# EasyEDA Pro project ProPrj_Solid Cell _2026-03-29.epro

# Schematic Schematic1
Board Name: Board1; Create Date: 2026-03-28; Page Name: P1; Project Name: Solid Cell; Schematic Name: Schematic1; Update Date: 2026-03-29; Company: EasyEDA.com; Page Size: A4; Version: V1.0
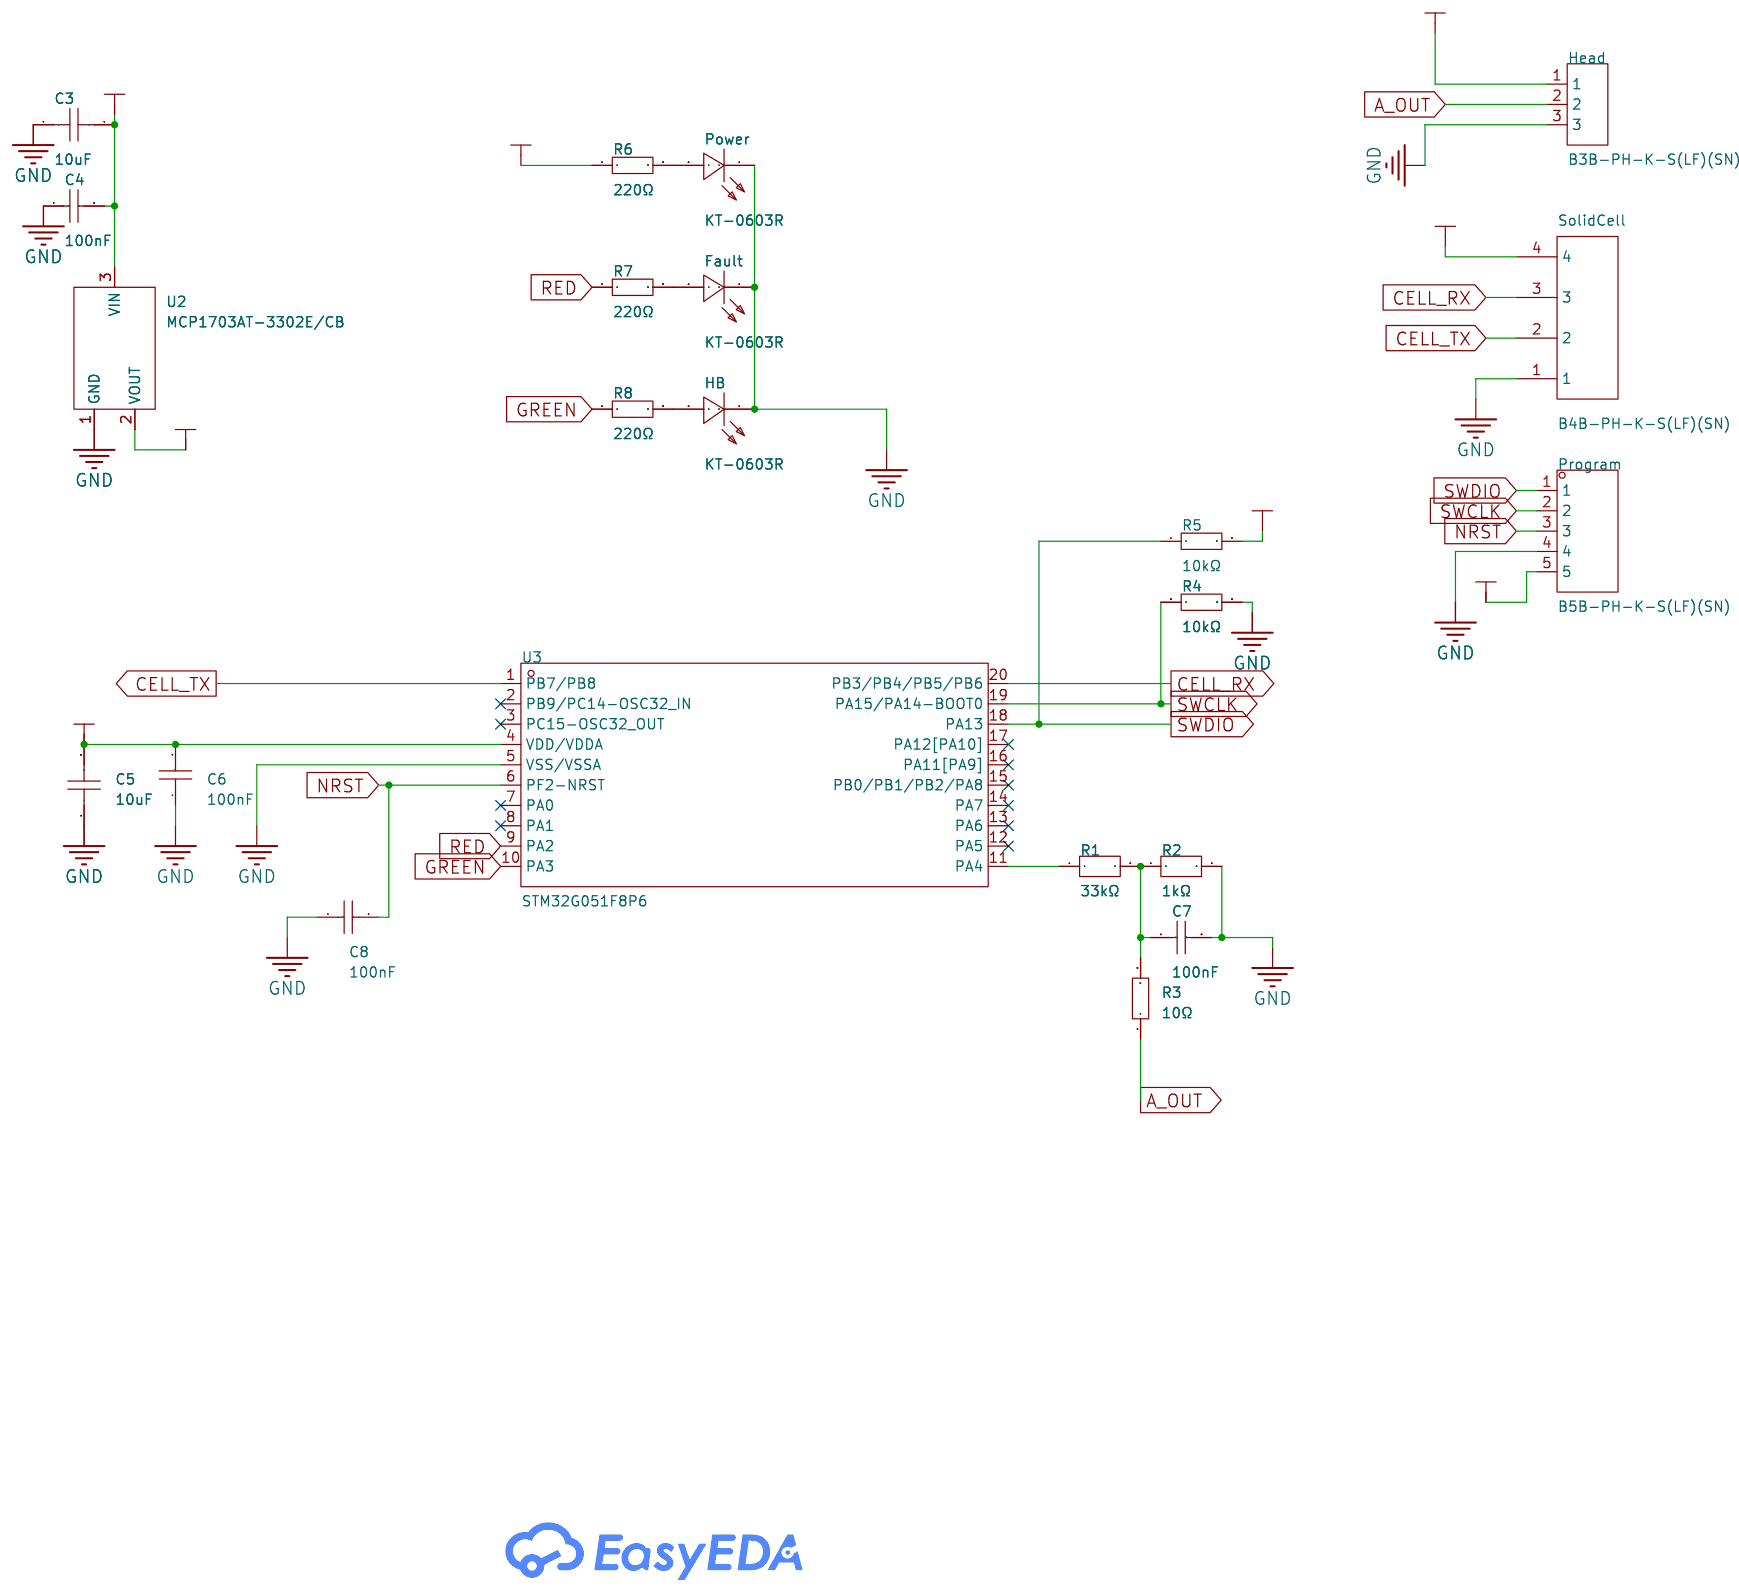
[diagram p0: schematic sheet]

## Parts
C3  10uF  [C0603]
C4  100nF  [C0603]
C5  10uF  [C0603]
C6  100nF  [C0603]
C7  100nF  [C0603]
C8  100nF  [C0603]
Fault  KT-0603R  [LED0603-RD]
HB  KT-0603R  [LED0603-RD]
Head  B3B-PH-K-S(LF)(SN)  [CONN-TH_B3B-PH-K-S]
Power  KT-0603R  [LED0603-RD]
Program  B5B-PH-K-S(LF)(SN)  [CONN-TH_B5B-PH-K-S-LF-SN]
R1  33kΩ  [R0603]
R2  1kΩ  [R0603]
R3  10Ω  [R0603]
R4  10kΩ  [R0603]
R5  10kΩ  [R0603]
R6  220Ω  [R0603]
R7  220Ω  [R0603]
R8  220Ω  [R0603]
SolidCell  B4B-PH-K-S(LF)(SN)  [CONN-TH_B4B-PH-K-S]
U2  MCP1703AT-3302E/CB  [SOT-23-3_L2.9-W1.3-P1.90-LS2.4-BR]
U3  STM32G051F8P6  [TSSOP-20_L6.5-W4.4-P0.65-LS6.4-BL]

## Library data of the parts
C3 C5 = CL10A106MA8NRNC: Capacitance:10uF Tolerance:±20% Tolerance:±20% Voltage Rating:25V Temperature Coefficient:X5R; LCSC Part Name: 10uF ±20% 25V; Supplier Part: C96446; Manufacturer: SAMSUNG(三星); Supplier Footprint: 0603; JLCPCB Part Class: Basic Part; Datasheet: https://item.szlcsc.com/datasheet/CL10A106MA8NRNC/97651.html; Supplier: LCSC; Tolerance: ±20%; Voltage Rating: 25V; Temperature Coefficient: X5R
C4 C6-C8 = CC0603KRX7R9BB104: Capacitance:100nF Tolerance:±10% Tolerance:±10% Voltage Rating:50V Temperature Coefficient:X7R; LCSC Part Name: 100nF ±10% 50V; Supplier Part: C14663; Manufacturer: YAGEO(国巨); Supplier Footprint: 0603; JLCPCB Part Class: Basic Part; Datasheet: https://item.szlcsc.com/datasheet/CC0603KRX7R9BB104/15331.html; Supplier: LCSC; Tolerance: ±10%; Voltage Rating: 50V; Temperature Coefficient: X7R; Check: true
Fault HB Power = KT-0603R: Lamp Holder Type:- Illumination Color:Red Voltage - Forward(Vf):1.8V~2.4V Voltage - Forward(Vf):1.8V~2.4V Power(Watts):40mW Forward Current:20mA Wavelength - Dominant:615nm~630nm Wavelength - Dominant:615nm~630nm Peak Wavelength:645nm Diode Configuration:; LCSC Part Name: 0603 红灯 高亮; Supplier Part: C2286; Manufacturer: KENTO; Supplier Footprint: 0603; JLCPCB Part Class: Basic Part; Datasheet: https://item.szlcsc.com/datasheet/KT-0603R/2659.html; Supplier: LCSC; Illumination Color: Red; Voltage - Forward(Vf): 1.8V~2.4V; Power(Watts): 40mW; Forward Current: 20mA; Wavelength - Dominant: 615nm~630nm; Peak Wavelength: 645nm; Diode Configuration: Discrete Diode; Lens Color: Water Clear; Luminous Intensity: 300mcd; Viewing Angle: 120°; Operating Temperature: -40℃~+85℃
Head = B3B-PH-K-S(LF)(SN): Pins Structure:1x3P Pitch:2mm Mounting Type:Through Hole Reference Series:PH Number of Pins:3P Number of Rows:1 Number of PINs Per Row:3 Row Spacing:- Current Rating:2A Contact Material:Brass Contact Plating:Tin Operating Temperature:-25℃~+85℃ Operating T; LCSC Part Name: 1x3P 间距:2mm 直插 系列:PH; Supplier Part: C131339; Manufacturer: JST; Supplier Footprint: 插件,P=2mm; JLCPCB Part Class: Extended Part; Datasheet: https://item.szlcsc.com/datasheet/B3B-PH-K-S(LF)(SN)/142632.html; Supplier: LCSC; Pins Structure: 1x3P; Pitch: 2mm; Mounting Type: Through Hole; Reference Series: PH; Number of Pins: 3P; Number of Rows: 1; Number of PINs Per Row: 3; Current Rating: 2A; Contact Material: Brass; Contact Plating: Tin; Operating Temperature: -25℃~+85℃; Voltage Rating: 100V; Plastic Material: PA66; Flame Retardant Rating: UL94V-0; Supplementary Features: K Pin; Color: White; Z-Height of the Board: 6mm; X-Length of Bottom Edge on Board (Spacing Line): 7.9mm; Y-Width of Bottom Edge on Board: 4.5mm; Check: true
Program = B5B-PH-K-S(LF)(SN): Pins Structure:1x5P Pitch:2mm Mounting Type:Through Hole Reference Series:PH Number of Pins:5P Number of Rows:1 Number of PINs Per Row:5 Row Spacing:- Current Rating:2A Contact Material:Brass Contact Plating:Tin Operating Temperature:-25℃~+85℃ Operating T; LCSC Part Name: 1x5P 间距:2mm 直插 系列:PH; Supplier Part: C157993; Manufacturer: JST; Supplier Footprint: 插件,P=2mm; JLCPCB Part Class: Extended Part; Datasheet: https://item.szlcsc.com/datasheet/B5B-PH-K-S(LF)(SN)/169341.html; Supplier: LCSC; Pins Structure: 1x5P; Pitch: 2mm; Mounting Type: Through Hole; Reference Series: PH; Number of Pins: 5P; Number of Rows: 1; Number of PINs Per Row: 5; Current Rating: 2A; Contact Material: Brass; Contact Plating: Tin; Operating Temperature: -25℃~+85℃; Voltage Rating: 100V; Plastic Material: PA66; Flame Retardant Rating: UL94V-0; Supplementary Features: K Pin; Color: White; Z-Height of the Board: 6mm; X-Length of Bottom Edge on Board (Spacing Line): 11.9mm; Y-Width of Bottom Edge on Board: 4.5mm; Check: true
R1 = 0603WAF3302T5E: Type:Thick Film Resistor Resistance:33kΩ Tolerance:±1% Tolerance:±1% Power(Watts):100mW Voltage-Supply(Max):75V Temperature Coefficient:±100ppm/℃ Temperature Coefficient:±100ppm/℃ Operating Temperature:-55℃~+155℃ Operating Temperature:-55℃~+155℃; LCSC Part Name: 33kΩ ±1% 100mW 厚膜电阻; Supplier Part: C4216; Manufacturer: UNI-ROYAL(厚声); Supplier Footprint: 0603; JLCPCB Part Class: Basic Part; Datasheet: https://item.szlcsc.com/datasheet/0603WAF3302T5E/4623.html; Supplier: LCSC; Type: Thick Film Resistor; Tolerance: ±1%; Power(Watts): 100mW; Voltage-Supply(Max): 75V; Temperature Coefficient: ±100ppm/℃; Operating Temperature: -55℃~+155℃
R2 = 0603WAF1001T5E: Type:Thick Film Resistor Resistance:1kΩ Tolerance:±1% Tolerance:±1% Power(Watts):100mW Voltage-Supply(Max):75V Temperature Coefficient:±100ppm/℃ Temperature Coefficient:±100ppm/℃ Operating Temperature:-55℃~+155℃ Operating Temperature:-55℃~+155℃; LCSC Part Name: 1kΩ ±1% 100mW 厚膜电阻; Supplier Part: C21190; Manufacturer: UNI-ROYAL(厚声); Supplier Footprint: 0603; JLCPCB Part Class: Basic Part; Datasheet: https://item.szlcsc.com/datasheet/0603WAF1001T5E/21904.html; Supplier: LCSC; Type: Thick Film Resistor; Tolerance: ±1%; Power(Watts): 100mW; Voltage-Supply(Max): 75V; Temperature Coefficient: ±100ppm/℃; Operating Temperature: -55℃~+155℃
R3 = 0603WAF100JT5E: Type:Thick Film Resistor Resistance:10Ω Tolerance:±1% Tolerance:±1% Power(Watts):100mW Voltage-Supply(Max):75V Temperature Coefficient:±400ppm/℃ Temperature Coefficient:±400ppm/℃ Operating Temperature:-55℃~+155℃ Operating Temperature:-55℃~+155℃; LCSC Part Name: 10Ω ±1% 100mW 厚膜电阻; Supplier Part: C22859; Manufacturer: UNI-ROYAL(厚声); Supplier Footprint: 0603; JLCPCB Part Class: Basic Part; Datasheet: https://item.szlcsc.com/datasheet/0603WAF100JT5E/23586.html; Supplier: LCSC; Type: Thick Film Resistor; Tolerance: ±1%; Power(Watts): 100mW; Voltage-Supply(Max): 75V; Temperature Coefficient: ±400ppm/℃; Operating Temperature: -55℃~+155℃
R4 R5 = 0603WAF1002T5E: Type:Thick Film Resistor Resistance:10kΩ Tolerance:±1% Tolerance:±1% Power(Watts):100mW Voltage-Supply(Max):75V Temperature Coefficient:±100ppm/℃ Temperature Coefficient:±100ppm/℃ Operating Temperature:-55℃~+155℃ Operating Temperature:-55℃~+155℃; LCSC Part Name: 厚膜电阻 10kΩ ±1% 100mW; Supplier Part: C25804; Manufacturer: UNI-ROYAL(厚声); Supplier Footprint: 0603; JLCPCB Part Class: Basic Part; Datasheet: https://item.szlcsc.com/datasheet/0603WAF1002T5E/26547.html; Supplier: LCSC; Type: Thick Film Resistor; Tolerance: ±1%; Power(Watts): 100mW; Voltage-Supply(Max): 75V; Temperature Coefficient: ±100ppm/℃; Operating Temperature: -55℃~+155℃
R6-R8 = 0603WAF2200T5E: Type:Thick Film Resistors Resistance: Tolerance:±1% Tolerance:±1% Power(Watts): Overload Voltage (Max): Temperature Coefficient:±100ppm/℃ Temperature Coefficient:±100ppm/℃ Operating Temperature Range:-55℃~+155℃ Operating Temperature Range:-55℃~+155℃; LCSC Part Name: 220Ω ±1% 100mW 厚膜电阻; Supplier Part: C22962; Manufacturer: UNI-ROYAL(厚声); Supplier Footprint: 0603; JLCPCB Part Class: Basic Part; Datasheet: https://atta.szlcsc.com/upload/public/pdf/source/20200306/C422600_1E6D84923E4A46A82E41ADD87F860B5C.pdf; Supplier: LCSC; Type: Thick Film Resistors; Tolerance: ±1%; Temperature Coefficient: ±100ppm/℃; Operating Temperature Range: -55℃~+155℃
SolidCell = B4B-PH-K-S(LF)(SN)_C131334: Pins Structure:1x4P Pitch:2mm Mounting Type:Through Hole Reference Series:PH Number of Pins:4P Number of Rows:1 Number of PINs Per Row:4 Row Spacing:- Current Rating:2A Contact Material:Brass Contact Plating:Tin Operating Temperature:-25℃~+85℃ Operating T; LCSC Part Name: 1x4P 间距:2mm 直插 系列:PH; Supplier Part: C131334; Manufacturer: JST; Supplier Footprint: 插件,P=2mm; JLCPCB Part Class: Extended Part; Datasheet: https://item.szlcsc.com/datasheet/B4B-PH-K-S(LF)(SN)/142627.html; Supplier: LCSC; Pins Structure: 1x4P; Pitch: 2mm; Mounting Type: Through Hole; Reference Series: PH; Number of Pins: 4P; Number of Rows: 1; Number of PINs Per Row: 4; Current Rating: 2A; Contact Material: Brass; Contact Plating: Tin; Operating Temperature: -25℃~+85℃; Voltage Rating: 100V; Plastic Material: PA66; Flame Retardant Rating: UL94V-0; Supplementary Features: K Pin; Color: White; Z-Height of the Board: 6mm; X-Length of Bottom Edge on Board (Spacing Line): 9.9mm; Y-Width of Bottom Edge on Board: 4.5mm; Check: true
U2 = MCP1703AT-3302E/CB: Output Type:Fixed Voltage - Supply:16V Output Voltage:3.3V Output Voltage:3.3V Output Current:250mA Power Supply Rejection Ratio (PSRR):35dB@(100Hz) Voltage Dropout:625mV@(250mA) standby current:2uA Noise:- Features:Over Current Protection；Short Circuit P; LCSC Part Name: 输入16V 输出3.3V 250mA; Supplier Part: C144183; Manufacturer: MICROCHIP(美国微芯); Supplier Footprint: SOT-23A-3; JLCPCB Part Class: Extended Part; Datasheet: https://item.szlcsc.com/datasheet/MCP1703AT-3302E%252FCB/155515.html; Supplier: LCSC; Output Type: Fixed; Voltage - Supply: 16V; Output Voltage: 3.3V; Output Current: 250mA; Power Supply Rejection Ratio (PSRR): 35dB@(100Hz); Voltage Dropout: 625mV@(250mA); standby current: 2uA; Features: Over Current Protection；Short Circuit Protection；Over Temperature Protection; Operating Temperature: -40℃~+125℃@(Tj); Output Configuration: Positive; Number of Outputs: 1; Check: true
U3 = STM32G051F8P6: LCSC Part Name: 主流Arm Cortex-M0+ 32位MCU，最高64KB闪存，18KB内存，2个USART，定时器，ADC，DAC，通信接口，1.7-3.6V; Supplier Part: C5270207; Manufacturer: ST(意法半导体); Supplier Footprint: TSSOP-20; JLCPCB Part Class: Extended Part; Datasheet: https://item.szlcsc.com/datasheet/STM32G051F8P6/5996616.html; Supplier: LCSC; Check: true

## Nets
+3V3: C5.2 C6.2 Program.5 R5.2 R6.1 SolidCell.4 U2.2(VOUT) U3.4(VDD/VDDA)
+7.5V: C3.2 C4.2 Head.1 U2.3(VIN)
GND: C3.1 C4.1 C5.1 C6.1 C7.2 C8.1 Fault.1(K) HB.1(K) Head.3 Power.1(K) Program.4 R2.2 R4.2 SolidCell.1 U2.1(GND) U3.5(VSS/VSSA)
A_OUT: Head.2 R3.1
CELL_RX: SolidCell.3 U3.20(PB3/PB4/PB5/PB6)
CELL_TX: SolidCell.2 U3.1(PB7/PB8)
GREEN: R8.1 U3.10(PA3)
NRST: C8.2 Program.3 U3.6(PF2-NRST)
RED: R7.1 U3.9(PA2)
SWCLK: Program.2 R4.1 U3.19(PA15/PA14-BOOT0)
SWDIO: Program.1 R5.1 U3.18(PA13)
$1N1443: C7.1 R1.2 R2.1 R3.2
$1N4879: R1.1 U3.11(PA4)
$1N7664: Power.2(A) R6.2
$1N7668: Fault.2(A) R7.2
$1N7672: HB.2(A) R8.2

Not connected (* = marked no-connect by the designer): U3 2(PB9/PC14-OSC32_IN)* 3(PC15-OSC32_OUT)* 7(PA0)* 8(PA1)* 12(PA5)* 13(PA6)* 14(PA7)* 15(PB0/PB1/PB2/PA8)* 16(PA11[PA9])* 17(PA12[PA10])*

# Board PCB1
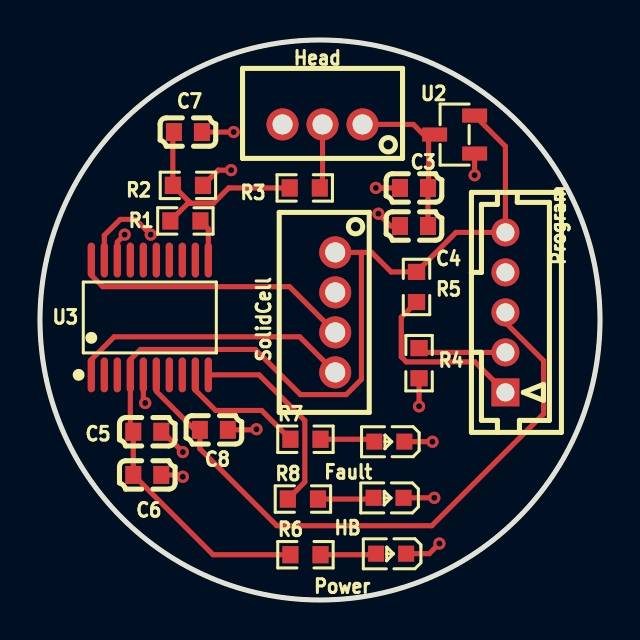
[diagram p1: board, top side]
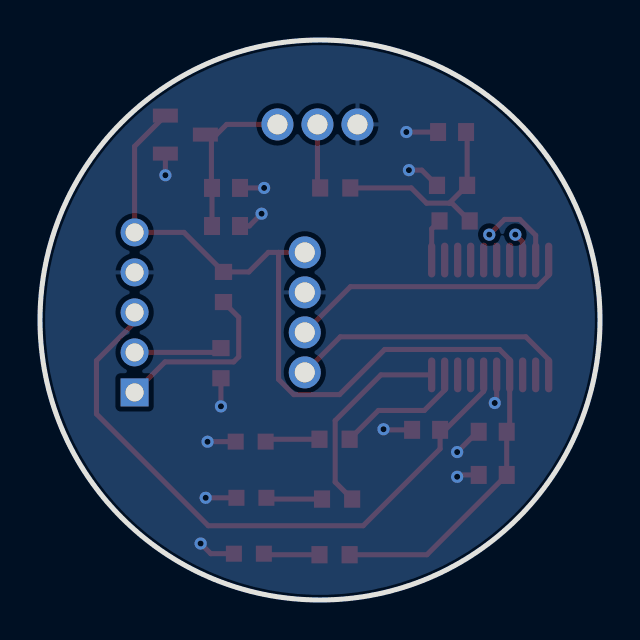
[diagram p2: board, bottom side, seen from below]

Outline 28 x 28 mm; copper layers: Top Layer, Inner1, Inner2, Bottom Layer. Coordinates in mm from the lower left corner of the outline.
Outline path: circle c14,14 r14
Stack: Top Layer 0.035mm Outer layer thickness 1oz / Dielectric1 0.2104mm 7628 RC49% 8.6mil / Inner1 0.0152mm Inner layer thickness / Dielectric2 1.065mm 1.1mm H/HOZ Copper / Inner2 0.0152mm Inner layer thickness / Dielectric3 0.2104mm 7628 RC49% 8.6mil / Bottom Layer 0.035mm Outer layer thickness 1oz

## Design rules (mm)
template: JLCPCB Capability(Two Layers Board)
spacing copperThickness1oz (default): track to track 0.102, other pairs 0.152 to 0.3
spacing copperThickness2oz: track to track 0.203, other pairs 0.152 to 0.3
track width copperThickness1oz (default): min 0.127, default 0.254, max 2.54
track width copperThickness2oz: min 0.203, default 0.254, max 2.54
differential pair differentialPair (default): width min 0.127, default 0.254, max 2.54; gap min 0.152, default 0.152
via viaSize (default): diameter min 0.5, default 0.61, max 10; hole min 0.3, default 0.305, max 6.3

## Placement (name value [footprint] x y rotation side)
C3  10uF  [C0603]  18.7 20.6 0 top
C4  100nF  [C0603]  18.7 18.7 0 top
C5  10uF  [C0603]  5.36 8.41 180 top
C6  100nF  [C0603]  5.36 6.25 180 top
C7  100nF  [C0603]  7.4 23.4 0 top
C8  100nF  [C0603]  8.69 8.51 180 top
Fault  KT-0603R  [LED0603-RD]  17.47 7.92 180 top
HB  KT-0603R  [LED0603-RD]  17.43 5.11 180 top
Head  B3B-PH-K-S(LF)(SN)  [CONN-TH_B3B-PH-K-S]  14.13 23.78 0 top
Power  KT-0603R  [LED0603-RD]  17.56 2.32 180 top
Program  B5B-PH-K-S(LF)(SN)  [CONN-TH_B5B-PH-K-S-LF-SN]  23.27 14.38 270 top
R1  33kΩ  [R0603]  7.27 18.95 180 top
R2  1kΩ  [R0603]  7.4 20.73 0 top
R3  10Ω  [R0603]  13.24 20.6 180 top
R4  10kΩ  [R0603]  18.95 11.84 270 top
R5  10kΩ  [R0603]  18.83 15.65 90 top
R6  220Ω  [R0603]  13.27 2.26 0 top
R7  220Ω  [R0603]  13.27 8.04 0 top
R8  220Ω  [R0603]  13.15 5.05 0 top
SolidCell  B4B-PH-K-S(LF)(SN)  [CONN-TH_B4B-PH-K-S]  14.76 14.38 90 top
U2  MCP1703AT-3302E/CB  [SOT-23-3_L2.9-W1.3-P1.90-LS2.4-BR]  20.73 23.27 0 top
U3  STM32G051F8P6  [TSSOP-20_L6.5-W4.4-P0.65-LS6.4-BL]  5.49 14.13 0 top

## Footprints (pads in the part's own frame, mm; a bottom-side part is the same pattern mirrored in y, then rotated)
C0603
  rect 0.8x0.9 smd: 1(-0.7,0) 2(0.7,0)
CONN-TH_B3B-PH-K-S
  round 1.6 hole 1: 1(2,0) 2(0,0) 3(-2,0)
CONN-TH_B4B-PH-K-S
  round 1.6 hole 1: 1(3,0) 2(1,0) 3(-1,0) 4(-3,0)
CONN-TH_B5B-PH-K-S-LF-SN
  rect 1.4x1.4 hole 0.9: 1(4,0)
  round 1.4 hole 0.9: 2(2,0) 3(0,0) 4(-2,0) 5(-4,0)
LED0603-RD
  rect 0.8x0.8 smd: 1(-0.749,0) 2(0.749,0)
R0603
  rect 0.806x0.864 smd: 1(-0.753,0) 2(0.753,0)
SOT-23-3_L2.9-W1.3-P1.90-LS2.4-BR
  rect 1.25x0.7 smd: 1(1,-0.95) 2(1,0.95) 3(-1,0)
TSSOP-20_L6.5-W4.4-P0.65-LS6.4-BL
  oval 0.364x1.742 smd: 1(-2.925,-2.871) 2(-2.275,-2.871) 3(-1.625,-2.871) 4(-0.975,-2.871) 5(-0.325,-2.871) 6(0.325,-2.871) 7(0.975,-2.871) 8(1.625,-2.871) 9(2.275,-2.871) 10(2.925,-2.871) 11(2.925,2.871) 12(2.275,2.871) 13(1.625,2.871) 14(0.975,2.871) 15(0.325,2.871) 16(-0.325,2.871) 17(-0.975,2.871) 18(-1.625,2.871) 19(-2.275,2.871) 20(-2.925,2.871)

## Nets
+3V3: C5.2 C6.2 Program.5 R5.2 R6.1 SolidCell.1 U2.2 U3.4
+7.5V: C3.2 C4.2 Head.1 U2.3
GND: C3.1 C4.1 C5.1 C6.1 C7.2 C8.1 Fault.1 HB.1 Head.3 Power.1 Program.4 R2.2 R4.2 SolidCell.2 U2.1 U3.5
A_OUT: Head.2 R3.1
GREEN: R8.1 U3.10
NRST: C8.2 Program.3 U3.6
RED: R7.1 U3.9
SWCLK: Program.2 R4.1 U3.19
SWDIO: Program.1 R5.1 U3.18
UART_RX_CELL: SolidCell.4 U3.1
UART_TX_CELL: SolidCell.3 U3.20
$1N1443: C7.1 R1.2 R2.1 R3.2
$1N4879: R1.1 U3.11
$1N7664: Power.2 R6.2
$1N7668: Fault.2 R7.2
$1N7672: HB.2 R8.2

Pads without a net: U3 2 3 7 8 12 13 14 15 16 17

## Via types
v1: diameter 0.61, hole 0.305, Top Layer to Bottom Layer, 15 vias

## Routing (per net, layer and track width the routed paths; a pad name or vN(x,y) marks a point on that pad's centre or on a via; arc(x,y) is an arc through that point)
+3V3: length 50.9
  Top Layer w0.254: U2.2 23.27,22.68 Program.5 20.8,18.38 R5.2 17.56,16.4 16.58,17.38 16.07,17.38 ; 16.07,17.38 SolidCell.1 ; 16.07,17.38 16.07,11.03 15.31,10.27 13.02,10.27 10.77,12.53 5.02,12.53 4.52,12.02 U3.4 4.52,8.56 C5.2 C6.2 8.65,2.26 R6.1
+7.5V: length 8.4
  Top Layer w0.254: Head.1 18.67,23.78 19.18,23.27 19.43,23.27 ; 19.43,23.27 U2.3 ; 19.43,23.27 19.43,20.63 C3.2 C4.2
GND: length 18.5
  Top Layer w0.254: Power.1 19.46,2.32 19.84,2.7 ; U2.1 v1(21.73,21.24) ; HB.1 v1(19.72,5.11) ; v1(10.82,8.54) 10.79,8.51 9.4,8.51 ; Fault.1 19.62,7.92 v1(19.62,7.91) ; v1(16.92,19.31) 17.54,18.7 C4.1 ; v1(7.14,7.4) 6.13,8.41 C5.1 ; v1(7.14,6.16) 7.05,6.25 C6.1 ; v1(5.26,9.85) 5.17,9.95 U3.5 ; R2.2 8.91,21.49 v1(9.56,21.49) ; R4.2 v1(18.95,9.68) ; C3.1 v1(16.79,20.6) ; C7.2 v1(9.68,23.4)
  vias: v1(19.97,2.82)
A_OUT: length 3.2
  Top Layer w0.254: Head.2 14.13,20.74 R3.1
GREEN: length 10
  Top Layer w0.254: U3.10 10.96,11.26 13.24,8.97 13.24,5.9 R8.1
NRST: length 31.7
  Top Layer w0.254: U3.6 5.82,10.43 7.74,8.51 7.99,8.51 7.99,7.56 11.84,3.71 19.59,3.71 25.18,9.3 25.18,11.97 23.27,13.87 Program.3
RED: length 6.5
  Top Layer w0.254: R7.1 11.08,9.48 8.78,9.48 7.77,10.49 U3.9
SWCLK: length 29
  Top Layer w0.254: v1(5.54,18.27) 4.77,19.03 4.01,19.03 3.22,18.23 U3.19 ; R4.1 19.17,12.38 Program.2
  Inner2 w0.254: v1(5.54,18.27) 5.75,18.48 17.18,18.48 Program.2
SWDIO: length 34.1
  Top Layer w0.254: v1(4.23,18.27) 3.87,17.9 U3.18 ; Program.1 21.75,11.91 18.32,11.91 18.06,12.16 18.06,14.14 R5.1
  Inner1 w0.254: v1(4.23,18.27) 5.5,17 5.76,17 7.27,18.51 15.4,18.51 23.27,10.64 Program.1
UART_RX_CELL: length 14.2
  Top Layer w0.254: U3.1 2.57,12.02 3.71,13.16 12.98,13.16 SolidCell.4
UART_TX_CELL: length 14.1
  Top Layer w0.254: SolidCell.3 12.48,15.67 3.13,15.67 2.57,16.24 U3.20
$1N1443: length 10.6
  Top Layer w0.254: R3.2 9.44,20.6 8.67,19.84 7.53,19.84 ; C7.1 6.64,23.34 R2.1 7.53,19.84 ; R1.2 7.4,19.84 7.53,19.84
$1N4879: length 2.1
  Top Layer w0.254: R1.1 8.42,18.56 U3.11
$1N7664: length 2.8
  Top Layer w0.254: Power.2 16.76,2.26 R6.2
$1N7668: length 2.7
  Top Layer w0.254: R7.2 16.6,8.04 Fault.2
$1N7672: length 2.8
  Top Layer w0.254: 13.9,5.05 16.62,5.05 HB.2

## Copper pours and planes (outline as drawn; the poured copper is in the pictures)
GND on Bottom Layer: -1.62,28.73 29.49,28.73 29.49,-1.24 -1.62,-1.24
